# EAGLE schematic 60-hv-amp-interlock (EAGLE 6.6.0)
AUTHOR: Sean Leavey; COMPANY: Institute for Gravitational Research; DATE: 2016-04-19; DESCRIPTION: Differential output +/-400V; FRMLATEXSYNTAX: 0; INFOSETTINGS: Used by 'plot.ulp' - do not edit manually! |FileTime=2016-07-15, 15:03:05|FileVersion=2||[LabelBox]|Company=Institute for Gravitational Research|Title=Quad Differential HV Amplifier|Description=Differential output +-350V|Revision=2016-03-22|Date=2016-03-22|Author=Sean Leavey|RevisionDate1=2016-05-30|RevisionAuthor1=Sean Leavey|RevisionDate2=2016-07-15|RevisionAuthor2=Sean Leavey|RevisionDate3=|RevisionAuthor3=|RevisionDate4=|RevisionAuthor4=|RevisionDate5=|RevisionAuthor5=||[FrontMatter]|DocTitle=Quad differential HV amplifier|SubTitle=Circuit board documentation|Authors=Sean Leavey|Keywords=|Abstract=This circuit provides four differential HV amplifier channels with +/-10V differential input and up to +/-400V differential output. Switchable whitening is provided to allow for additional filtering. This is switched via digital CMOS integrated circuits, and a connector compatible with the ERC Speedmeter project's CDS digital signalling system must be utilised. In addition, further connectors are provided for monitor signals and front panel indicator LEDs.\n\nThere are 8 x PA95 power amplifiers on this board which produce considerable heat. You must attach these amplifiers to a heat sink, and isolated copper has been left at the top of the board to do so. Two sockets are available for the attachment of 12V fans, but these are not strictly necessary depending on the chosen enclosure, heat sink and available air flow - use common sense.\n\nThis board contains numerous vias which must be populated prior to operation. Use the vias diagram in this documentation to find their locations, and make a visual inspection to make sure there are no unsoldered component legs where there are connected tracks. If in doubt, solder it!\n\nIt is highly recommended to build this board in a modular form, testing it as you go. There are test pins provided for most critical signal paths. It will be difficult to debug this circuit after it is complete.\n\nResistors should have 1% tolerance unless otherwise stated. This includes the HV feedback resistors.|LaTeXSyntax=1||[Safety]|VoltageHazard=1|HeatHazard=1|Convection=1|ForcedAir=1|WaterCooling=0|LightHazard=0|LaserPower=1000|LaserWavelength=1064|LaserClass=6|LightPower=1000|LightInvisible=0||[Notes]|Machinery=0|IntendedUsers=0|DisplayHints=1|; PLOTSETTINGS: Used by 'plot.ulp' - do not edit manually! |FileTime=2016-07-15, 15:03:05|FileVersion=2||[Board]|CreateBoard=0|PadDisplay=0|CreateDrillPlan=0|SiebMeyerFormat=0|IsiDrillFormat=0|CreateSolderStop=0|CreateCreamMask=0|CreateLegend=0|DisplayDimension=0|DisplayReference=1|CompensateSkew=1||[Documentation]|CreateDocumentation=1|CreateSheetDocs=1|DisplayNames=1|DisplayValues=1|DisplaySimulate=0|CreatePartList=0|CreateBoardDocs=1|CreatePlaceplan=1|DisplayJumper=0|CreateWiring=0|DisplayVias=1|CreateDrillMap=1|Create800uMap=0|CreatePreview=0|CreateValueList=1|CreateNetList=0|CreateLaTeX=1||[Variants]|HighlightUndefines=1|HighlightVariants=1|ShowVariantLists=1||[BoardSetup]|ProcessPolygons=0|PageSize=1|PageOrientation=0|MarginLeft=5|MarginTop=5|MarginRight=5|MarginBottom=5|DrillRackMM=0||[DocumentationSetup]|BlackWhite=0|FigureWidth=168|FigureHeight=237|ShrinkFigure=1|ExpandFigure=0|FigureRotate=1|TextWidth=72|ValueLibrary=1|PalatinoFont=1|LuximonoFont=1|IgnoreWidth=1||[MiscSetup]|OutlinePrecision=0.5|OutlineDiameter=2|; REVISION: v2.1; REVISIONAUTHOR1: Sean Leavey; REVISIONAUTHOR2: Sean Leavey; REVISIONDATE1: 2016-05-30; REVISIONDATE2: 2016-07-15; TITLE: Quad Differential; TITLE2: HV Amplifier; VARIANTSETTINGS: Used by 'variants.ulp' - do not edit manually! |FileTime=2013-05-23, 16:49:02|FileVersion=1||Title0=0-400V|Description0=|
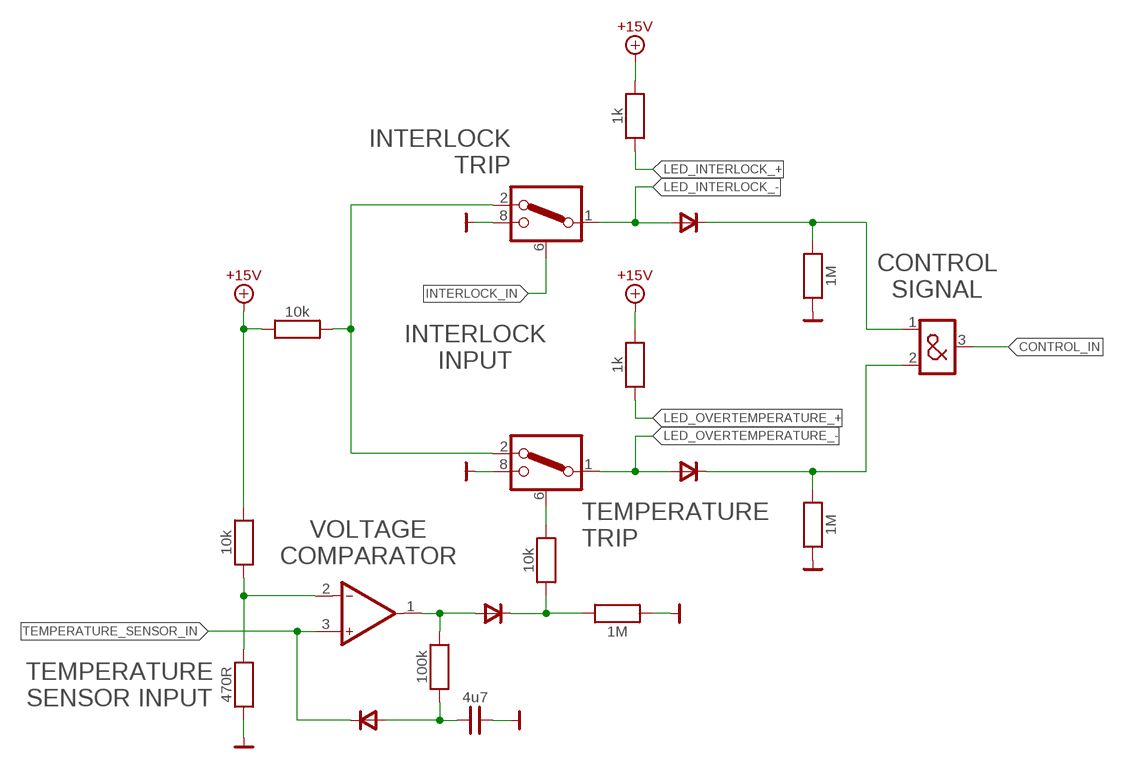
[diagram p0: schematic, sheet 1]

## Parts
C21  4u7  C02-MKS2-7.0-N  [C02-MKS2-7.0-N]
D17  1N4148  1N4148-04  [D04N-DO35-TYPE]
D21  1N4148  1N4148-04  [D04N-DO35-TYPE]
D25  1N4148  1N4148-04  [D04N-DO35-TYPE]
D26  1N4148  1N4148-04  [D04N-DO35-TYPE]
N21  OPA4277  OPA4277L  [DIP14L]
N22  MAX4659  DG419L  [DIP08L]
N23  MAX4659  DG419L  [DIP08L]
N24  4081  4081L  [DIP14L]
R1  1M  R04  [R04N]
R97  10k  RN  [R04N]
R98  470R  RN  [R04N]
R105  100k  RN  [R04N]
R109  10k  R04  [R04N]
R110  10k  RN  [R04N]
R111  1k  R04  [R04N]
R112  1k  R04  [R04N]
R150  1M  R04  [R04N]
R151  1M  R04  [R04N]

## Nets
+15V: R97.2 R109.1 R111.2 R112.2 ; supply symbol labelled V+15V
CONTROL_IN: N24.3(A:O)
GND: C21.1 N22.8(A:S2B) N23.8(A:S2B) R1.1 R98.1 R150.1 R151.1 ; supply symbol labelled VG
INTERLOCK_IN: N22.6(A:D)
LED_INTERLOCK_+: R111.1
LED_INTERLOCK_-: D25.A N22.1(A:S1)
LED_OVERTEMPERATURE_+: R112.1
LED_OVERTEMPERATURE_-: D26.A N23.1(A:S1)
N$15: N22.2(A:S2A) N23.2(A:S2A) R109.2
N$28: D21.C R1.2 R110.1
N$35: D26.C N24.2(A:I2) R151.2
N$50: D25.C N24.1(A:I1) R150.2
N$58: N23.6(A:D) R110.2
N$60: N21.2(A:IN-) R97.1 R98.2
N$64: D21.A N21.1(A:OUT) R105.2
N$66: C21.2 D17.A R105.1
TEMPERATURE_SENSOR_IN: D17.C N21.3(A:IN+)
Unconnected: N21.5(B:IN+) N21.6(B:IN-) N21.7(B:OUT) N21.8(C:OUT) N21.9(C:IN-) N21.10(C:IN+) N21.12(D:IN+) N21.13(D:IN-) N21.14(D:OUT) N24.4(B:O) N24.5(B:I1) N24.6(B:I2) N24.8(C:I1) N24.9(C:I2) N24.10(C:O) N24.11(D:O) N24.12(D:I1) N24.13(D:I2)

## Notes on the sheet
- INTERLOCK
  TRIP
- CONTROL
  SIGNAL
- INTERLOCK
  INPUT
- TEMPERATURE
  TRIP
- VOLTAGE
  COMPARATOR
- TEMPERATURE
  SENSOR INPUT

## Power pins joined to a net without a drawn wire
GND: N22.3(P:GND) N23.3(P:GND) N24.7(P:GND)
V+: N21.4(P:V+) N22.4(P:V+) N23.4(P:V+) N24.14(P:V+)
V-: N21.11(P:V-) N22.7(P:V-) N23.7(P:V-)
VL: N22.5(P:VL) N23.5(P:VL)

## Library data of the parts
C21 = miscs:C: Capacitor, bipolar _____ Supported SPICE attributes: VALUE, VOLTAGE, CPARALLEL, LSERIES, RLSHUNT, RPARALLEL, RSERIES (A detailed description of these parameters can be found in the library spice.lbr) _____ References (PDF files, electronics workshop server): WIMA FKP 02 <http://elektronik.aei.uni-hannover.de:3000/datasheets/capacitors/wima-fkp02.pdf> (polypropylene film capacitors, 0.1" spacing) WIMA FKP 2 <http://elektronik.aei.uni-hannover.de:3000/datasheets/capacitors/wima-fkp2.pdf> (polypropylene film capacitors, 0.2" spacing) WIMA FKS 2 <http://elektronik.aei.uni-hannover.de:3000/datasheets/capacitors/wima-fks2.pdf> (polyester film capacitors, 0.2" spacing) WIMA MKP 2 <http://elektronik.aei.uni-hannover.de:3000/datasheets/capacitors/wima-mkp2.pdf> (polypropylene film capacitors, 0.2" spacing) WIMA MKS 02 <http://elektronik.aei.uni-hannover.de:3000/datasheets/capacitors/wima-mks02.pdf> (polyester film capacitors, 0.1" spacing) WIMA MKS 2 <http://elektronik.aei.uni-hannover.de:3000/datasheets/capacitors/wima-mks2.pdf> (polyester film capacitors, 0.2" spacing) Kemet ceramics <http://elektronik.aei.uni-hannover.de:3000/datasheets/capacitors/kemet-ceramics.pdf> (multilayer ceramic leaded capacitors) Vishay ceramics HV <http://elektronik.aei.uni-hannover.de:3000/datasheets/capacitors/vishay-ceramic-hv.pdf> (multilayer ceramic leaded capacitors, high voltage) LCR polystyrene <http://elektronik.aei.uni-hannover.de:3000/datasheets/capacitors/lcr-polystyrene.pdf> (polystyrene radial capacitors, 0.2" spacing); SPICE: <IDEALMODEL>\n<name:C> <pin:A.1> <pin:A.2> <autovalue><voltage: ic=>\n\n<REALMODEL>\n<name:C> <pin:A.1> <pin:A.2> <autovalue><voltage: ic=><rseries: rser=><lseries: lser=><rparallel: rpar=><cparallel: cpar=><rlshunt: rlshunt=>
D17 D21 D25 D26 = diodes:1N4148: 1N4148/LL4148/1N4448/LL4448: General purpose silicon diode 100V, 200mA, 500mW, 1V @ 10mA Wired packages: 1N4148/1N4448, MiniMELF package: LL4148/LL4448 _____ Supported SPICE subcircuits: 1N4148-SUB Supported SPICE attributes: TEMPERATURE; SPICE: <name:X> <pin:A.A> <pin:A.C> <subckt:1N4148-SUB><temperature: devicetemp=>; TYPE: 1N4148
N21 = opamps:OPA4277: OPA4277: Quad high precision opamp (Burr-Brown) ±15V, ±35mA, 4nA bias 50µV offset, 1MHz UGF, 8nV/rt(Hz) noise _____ References: - PDF datasheet <http://elektronik.aei.uni-hannover.de:3000/datasheets/opamps/opamps/opa4277.pdf> (electronics workshop server) - Manufacturer's link <http://www.ti.com/product/opa4277> (Texas Instruments website) - Internet search <http://www.google.de/search?q=opa4277 amplifier> (Google results) _____ Supported SPICE subcircuits: OPA277; SPICE: <gate:A>\n <name:X> <pin:A.IN+> <pin:A.IN-> <pin:P.V+> <pin:P.V-> <pin:A.OUT> <subckt:OPA277>\n\n<gate:B>\n <name:X> <pin:B.IN+> <pin:B.IN-> <pin:P.V+> <pin:P.V-> <pin:B.OUT> <subckt:OPA277>\n\n<gate:C>\n <name:X> <pin:C.IN+> <pin:C.IN-> <pin:P.V+> <pin:P.V-> <pin:C.OUT> <subckt:OPA277>\n\n<gate:D>\n <name:X> <pin:D.IN+> <pin:D.IN-> <pin:P.V+> <pin:P.V-> <pin:D.OUT> <subckt:OPA277>\n\n<gate:P>\n <ignore>
N22 N23 = ics:DG419: DG419: SPDT analog switch (Maxim) ±15V, 30Ω Ron, 175ns tswitch TTL level inputs, separate digital supply _____ References: - PDF datasheet <http://elektronik.aei.uni-hannover.de:3000/datasheets/ics/switches-multiplexers/dg419.pdf> (electronics workshop server) - Manufacturer's link <http://www.maximintegrated.com/datasheet/index.mvp/id/1005> (Maxim website) - Internet search <http://www.google.de/search?q=dg419> (Google results); VALUE: DG419
N24 = digitals:*4081: xx4081: Quad 2-input AND gate ____ References: - PDF datasheets: CMOS <http://elektronik.aei.uni-hannover.de:3000/datasheets/digitals/gates/and-nand/4081.pdf> (electronics workshop server) - Manufacturer's links: CMOS <http://www.ti.com/product/cd4081b> (Texas Instruments) - Internet search: CMOS <https://www.google.de/search?q=4081> (Google results)
R1 R97 R98 R105 R109-R112 R150 R151 = miscs:R: Resistor, European symbol _____ Supported SPICE attributes: VALUE (A detailed description of these parameters can be found in the library spice.lbr); SPICE: <name:R> <pin:A.1> <pin:A.2> <autovalue>

## Net classes
0 default: width 0.813 mm, drill 0.813 mm, clearance 0.406 mm
1 HV: width 1.626 mm, drill 0.813 mm, clearance 0.813 mm